# Altium project PCB_Project.PrjPcb
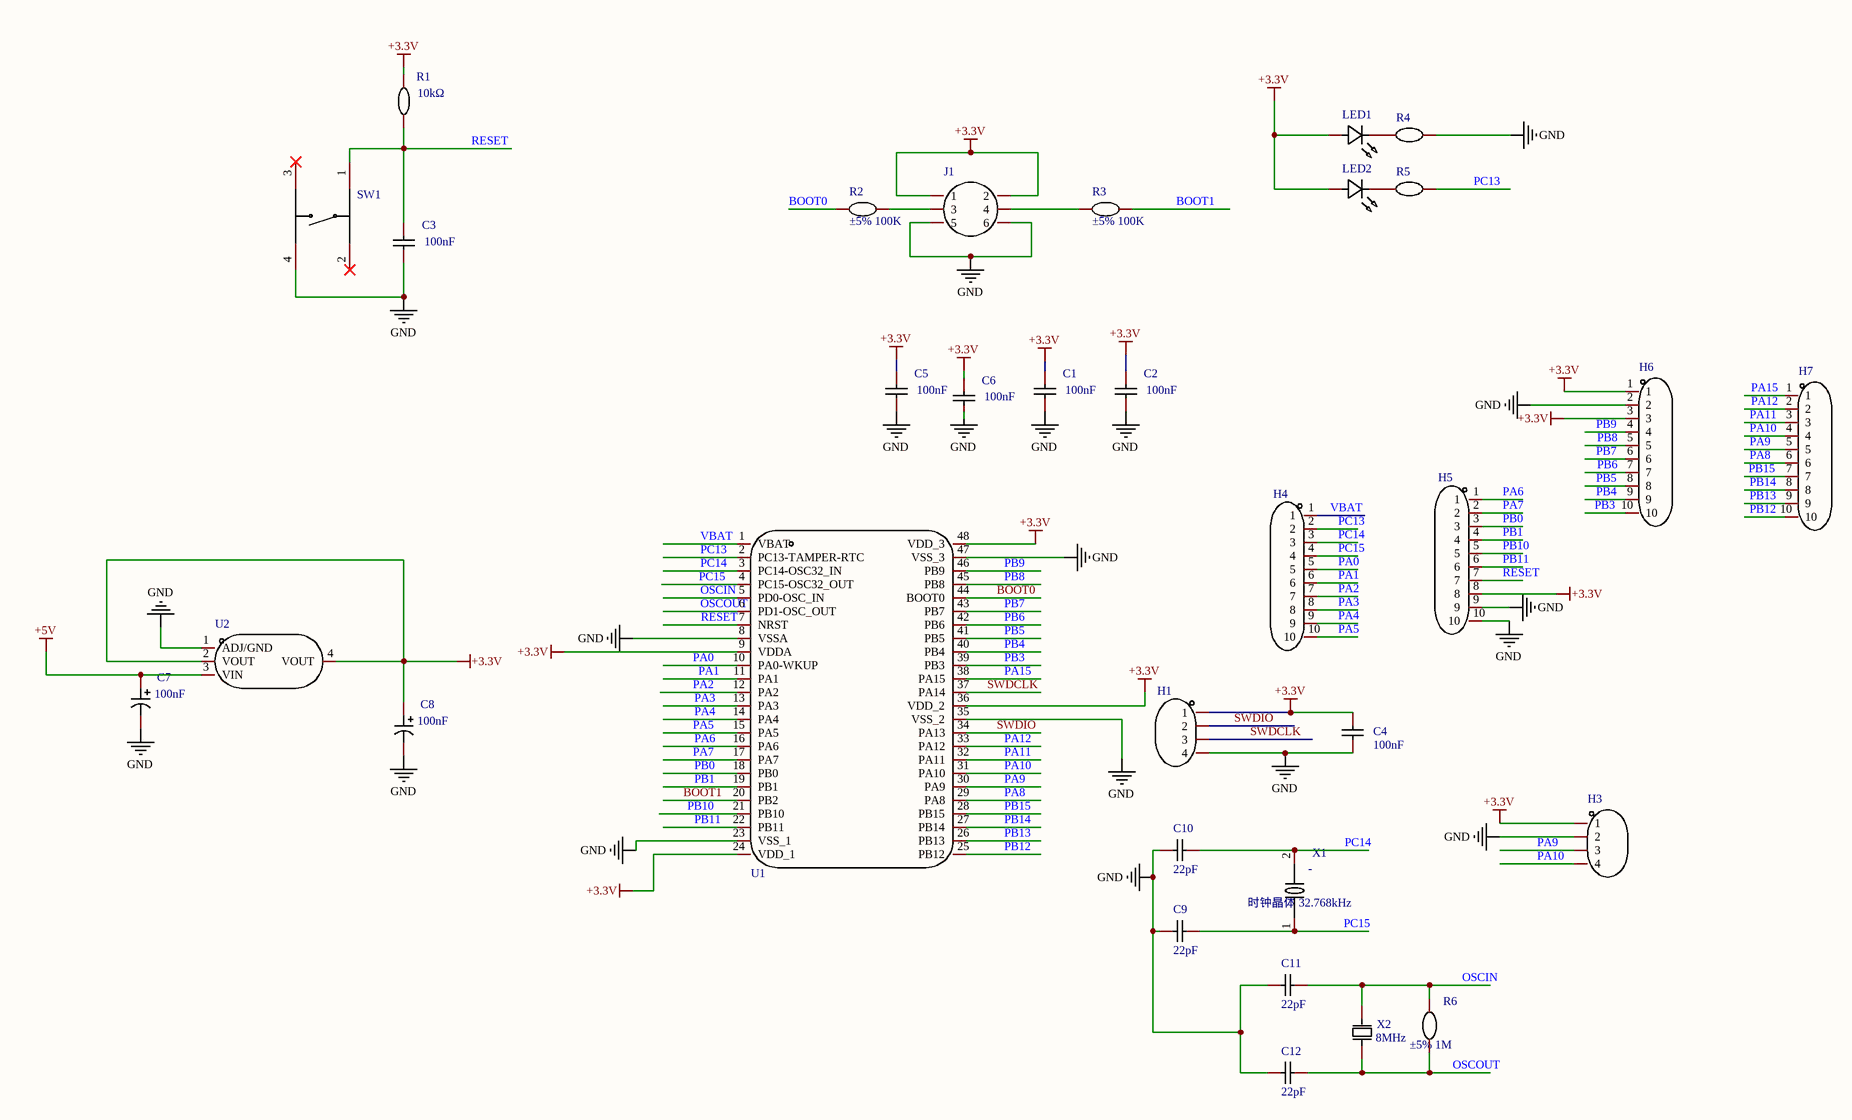
[diagram p0: 1_P1.schdoc]
1 sheet, 32 parts. Net scope: global (net labels, ports and power ports of the same name join across sheets).
Board file: PCB1.PcbDoc

## Sheet 1_P1.schdoc
size 431 x 309 mm; SheetNumber: 1; SheetTotal: 1

### Parts
C1  value 100nF  [C0603]  (hidden comment: CL10F104ZB8NNNC)
C2  value 100nF  [C0603]  (hidden comment: CL10F104ZB8NNNC)
C3  value 100nF  [C0603]  (hidden comment: CL10F104ZB8NNNC)
C4  value 100nF  [C0603]  (hidden comment: CL10F104ZB8NNNC)
C5  value 100nF  [C0603]  (hidden comment: CL10F104ZB8NNNC)
C6  value 100nF  [C0603]  (hidden comment: CL10F104ZB8NNNC)
C7  value 100nF  [CAP-SMD_L3.2-W1.6-RD]  (hidden comment: CA45-A-35V-0.1UF-K)
C8  value 100nF  [CAP-SMD_L3.2-W1.6-RD]  (hidden comment: CA45-A-35V-0.1UF-K)
C9  value 22pF  [C0603]  (hidden comment: CL10C220JB8NNNC)
C10  value 22pF  [C0603]  (hidden comment: CL10C220JB8NNNC)
C11  value 22pF  [C0603]  (hidden comment: CL10C220JB8NNNC)
C12  value 22pF  [C0603]  (hidden comment: CL10C220JB8NNNC)
H1  B-2100S04P-A110  [HDR-TH_4P-P2.54-V-M]  (value not drawn)
H3  B-2100S04P-A110  [HDR-TH_4P-P2.54-V-M]  (value not drawn)
H4  2.54-1*10P针  [HDR-TH_10P-P2.54-V-M-1]  (value not drawn)
H5  2.54-1*10P针  [HDR-TH_10P-P2.54-V-M-1]  (value not drawn)
H6  2.54-1*10P针  [HDR-TH_10P-P2.54-V-M-1]  (value not drawn)
H7  2.54-1*10P针  [HDR-TH_10P-P2.54-V-M-1]  (value not drawn)
J1  2.54-2*3P针  [HDR-TH_6P-P2.54-V-M-R2-C3-S2.54-1]  (value not drawn)
LED1  67-21/RSC-FT2V1B/2T_1  [LED-SMD_L3.1-W2.7-FD-1]  (value not drawn)
LED2  67-21/RSC-FT2V1B/2T_1  [LED-SMD_L3.1-W2.7-FD-1]  (value not drawn)
R1  value 10kΩ  [R1206]  (hidden comment: TR1206D9K00P0550Z)
R2  LCSC Part Name: ±5% 100K  [R2512]  (hidden comment: SCR2512J100K)
R3  LCSC Part Name: ±5% 100K  [R2512]  (hidden comment: SCR2512J100K)
R4  SCR0603J510R  [R0603]  (value not drawn)
R5  SCR0603J510R  [R0603]  (value not drawn)
R6  LCSC Part Name: ±5% 1M  [R0603]  (hidden comment: SCR0603J1M)
SW1  TS-KG02S  [SW-SMD_4P-L6.0-W6.0-P3.90-LS9.5]  (value not drawn)
U1  STM32F103C8T6  [LQFP-48_L7.0-W7.0-P0.50-LS9.0-BL]  (value not drawn)
U2  AMS1117-3.3_C351785  [SOT-223_L6.5-W3.5-P2.30-LS7.0-BR]  (value not drawn)
X1  LCSC Part Name: 时钟晶体 32.768kHz  [OSC-SMD_2P-L1.6-W1.0]  (hidden comment: TFX-04-32.768K)
X2  value 8MHz  [OSC-TH_L11.1-W4.7-P4.88]  (hidden comment: 49SAC08000∞2060)

### Nets
+3.3V: C1.2 C2.2 C4.1 C5.2 C6.2 C8.1 H1.1 H3.1 H5.8 H6.1 H6.3 J1.1 J1.2 LED1.1 LED2.1 R1.2 U1.9(VDDA) U1.24(VDD_1) U1.36(VDD_2) U1.48(VDD_3) U2.2(VOUT) U2.4(VOUT)
+5V: C7.1 U2.3(VIN)
GND: C1.1 C2.1 C3.1 C4.2 C5.1 C6.1 C7.2 C8.2 C9.1 C10.1 C11.1 C12.1 H1.4 H3.2 H5.9 H5.10 H6.2 J1.5 J1.6 R4.2 SW1.4 U1.8(VSSA) U1.23(VSS_1) U1.35(VSS_2) U1.47(VSS_3) U2.1(ADJ/GND)
BOOT0: R2.1 U1.44(BOOT0)
BOOT1: R3.2 U1.20(PB2)
OSCIN: C11.2 R6.2 U1.5(PD0-OSC_IN) X2.2(OSC2)
OSCOUT: C12.2 R6.1 U1.6(PD1-OSC_OUT) X2.1(OSC1)
PA0: H4.5 U1.10(PA0-WKUP)
PA1: H4.6 U1.11(PA1)
PA2: H4.7 U1.12(PA2)
PA3: H4.8 U1.13(PA3)
PA4: H4.9 U1.14(PA4)
PA5: H4.10 U1.15(PA5)
PA6: H5.1 U1.16(PA6)
PA7: H5.2 U1.17(PA7)
PA8: H7.6 U1.29(PA8)
PA9: H3.3 H7.5 U1.30(PA9)
PA10: H3.4 H7.4 U1.31(PA10)
PA11: H7.3 U1.32(PA11)
PA12: H7.2 U1.33(PA12)
PA15: H7.1 U1.38(PA15)
PB0: H5.3 U1.18(PB0)
PB1: H5.4 U1.19(PB1)
PB3: H6.10 U1.39(PB3)
PB4: H6.9 U1.40(PB4)
PB5: H6.8 U1.41(PB5)
PB6: H6.7 U1.42(PB6)
PB7: H6.6 U1.43(PB7)
PB8: H6.5 U1.45(PB8)
PB9: H6.4 U1.46(PB9)
PB10: H5.5 U1.21(PB10)
PB11: H5.6 U1.22(PB11)
PB12: H7.10 U1.25(PB12)
PB13: H7.9 U1.26(PB13)
PB14: H7.8 U1.27(PB14)
PB15: H7.7 U1.28(PB15)
PC13: H4.2 R5.2 U1.2(PC13-TAMPER-RTC)
PC14: C10.2 H4.3 U1.3(PC14-OSC32_IN) X1.2
PC15: C9.2 H4.4 U1.4(PC15-OSC32_OUT) X1.1
RESET: C3.2 H5.7 R1.1 SW1.1 U1.7(NRST)
SWDCLK: H1.3 U1.37(PA14)
SWDIO: H1.2 U1.34(PA13)
VBAT: H4.1 U1.1(VBAT)
NetJ1_3: J1.3 R2.2
NetJ1_4: J1.4 R3.1
NetLED1_2: LED1.2 R4.1
NetLED2_2: LED2.2 R5.1

Not connected (* = marked no-connect by the designer): SW1 2* 3*

### Library data of the parts
C1-C6 = CL10F104ZB8NNNC: 容值:100nF;精度:-20%~+80%;额定电压:50V;材质(温度系数):Y5V;; Manufacturer: SAMSUNG(三星); Add into BOM: yes; Voltage Rated: 50V; Temperature Coefficient: Y5V; Symbol: CL10F104ZB8NNNC; Device: CL10F104ZB8NNNC; LCSC Part Name: 100nF -20%~+80% 50V; Supplier Part: C1688; Manufacturer Part: CL10F104ZB8NNNC; Supplier Footprint: 0603; JLCPCB Part Class: Extended Part; Datasheet: https://atta.szlcsc.com/upload/public/pdf/source/20160103/1457707690730.pdf; Supplier: LCSC; Convert to PCB: yes; Tolerance: -20%~+80%
C7 C8 = CA45-A-35V-0.1UF-K: 容值:100nF;精度:±10%;额定电压:35V;工作温度:-55~+125;; Manufacturer: CEC(振华新云); Add into BOM: yes; Tolerance: ±10%; Rated Voltage: 35V; Symbol: CA45-A-35V-0.1UF-K; Device: CA45-A-35V-0.1UF-K; LCSC Part Name: 100nF ±10% 35V; Supplier Part: C2976900; Manufacturer Part: CA45-A-35V-0.1UF-K; Supplier Footprint: SMD,3.2x1.6x1.6mm; JLCPCB Part Class: Extended Part; Datasheet: https://atta.szlcsc.com/upload/public/pdf/source/20220222/C2C5F368BEBB90E653B4407F98E5644A.pdf; Supplier: LCSC; Convert to PCB: yes; Operating Temperature: -55~+125
C9-C12 = CL10C220JB8NNNC: 容值:22pF;精度:±5%;额定电压:50V;材质(温度系数):C0G;; Manufacturer: SAMSUNG(三星); Add into BOM: yes; Tolerance: ±5%; Voltage Rated: 50V; Temperature Coefficient: C0G; Symbol: CL10C220JB8NNNC; Device: CL10C220JB8NNNC; LCSC Part Name: 22pF ±5% 50V; Supplier Part: C1653; Manufacturer Part: CL10C220JB8NNNC; Supplier Footprint: 0603; JLCPCB Part Class: Basic Part; Datasheet: https://atta.szlcsc.com/upload/public/pdf/source/20160103/1457707687317.pdf; Supplier: LCSC; Convert to PCB: yes
H1 H3 = B-2100S04P-A110: 间距:2.54mm;总PIN位数:4;排数:1;插针结构:1x4P;行距:-;安装类型:直插;圆针/方针:-;额定电流:-;额定电压:-;配合针长度:6mm;塑高:2.54mm;端接针长度:3mm;触头材质:黄铜;触头镀层:-;工作温度范围:-40~+105;颜色:黑色;; Manufacturer: Ckmtw(灿科盟); Symbol: Header-Male-2.54_1x4; Add into BOM: yes; Pitch: 2.54mm; Pin Structure: 1x4P; Device: B-2100S04P-A110; LCSC Part Name: 2.54mm 1x4P 直插; Supplier Part: C124378; Manufacturer Part: B-2100S04P-A110; Supplier Footprint: 直插,P=2.54mm; JLCPCB Part Class: Extended Part; Datasheet: https://atta.szlcsc.com/upload/public/pdf/source/20170821/C124378_1503303307508901532.pdf; Supplier: LCSC; Convert to PCB: yes; Number of Pins: 4; Number of Rows: 1; Row Spacing: -; Mounting Type: 直插; Circluar Pins/Square Pins: -; Current Rating (Max): -; Voltage Rating (Max): -; Length of Mating Pin: 6mm; Insulation Height: 2.54mm; Length of End Connection Pin: 3mm; Contact Material: 黄铜; Contact Plating: -; Operating Temperature Range: -40~+105; Color: 黑色
H4-H7 = 2.54-1*10P针: 间距:2.54mm;总PIN位数:10;排数:1;插针结构:1x10P;行距:-;安装类型:直插;圆针/方针:方针;额定电流:3A;额定电压:-;配合针长度:-;塑高:-;端接针长度:-;触头材质:-;触头镀层:-;工作温度范围:-40~+105;颜色:黑色;; Manufacturer: BOOMELE(博穆精密); Symbol: Header-Male-2.54_1x10; Add into BOM: yes; Pitch: 2.54mm; Pin Structure: 1x10P; Circluar Pins/Square Pins: 方针; Current Rating (Max): 3A; Device: 2.54-1*10P针; LCSC Part Name: 2.54mm 1x10P 直插 方针; Supplier Part: C57369; Manufacturer Part: 2.54-1*10P针; Supplier Footprint: 插件,P=2.54mm; JLCPCB Part Class: Extended Part; Datasheet: https://atta.szlcsc.com/upload/public/pdf/source/20151109/1457707572883.pdf; Supplier: LCSC; Convert to PCB: yes; Number of Pins: 10; Number of Rows: 1; Row Spacing: -; Mounting Type: 直插; Voltage Rating (Max): -; Length of Mating Pin: -; Insulation Height: -; Length of End Connection Pin: -; Contact Material: -; Contact Plating: -; Operating Temperature Range: -40~+105; Color: 黑色
J1 = 2.54-2*3P针: 间距:2.54mm;总PIN位数:6;排数:2;插针结构:-;行距:-;安装类型:直插;圆针/方针:-;额定电流:-;额定电压:-;配合针长度:-;塑高:-;触头材质:-;触头镀层:-;颜色:黑色;; Manufacturer: BOOMELE(博穆精密); Symbol: Header-Male-2.54_2x3; Add into BOM: yes; Pitch: 2.54mm; Device: 2.54-2*3P针; LCSC Part Name: 2.54mm 直插; Supplier Part: C65114; Manufacturer Part: 2.54-2*3P针; Supplier Footprint: 直插,P=2.54mm; JLCPCB Part Class: Extended Part; Datasheet: https://atta.szlcsc.comnull; Supplier: LCSC; Convert to PCB: yes; Number of Pins: 6; Number of Rows: 2; Pin Structure: -; Row Spacing: -; Mounting Type: 直插; Circluar Pins/Square Pins: -; Current Rating (Max): -; Voltage Rating (Max): -; Length of Mating Pin: -; Insulation Height: -; Contact Material: -; Contact Plating: -; Color: 黑色
LED1 LED2 = 67-21/RSC-FT2V1B/2T_1: Manufacturer: EVERLIGHT(亿光); Symbol: 67-21/RSC-FT2V1B/2T_C4749159; Add into BOM: yes; Device: 67-21/RSC-FT2V1B/2T_1; LCSC Part Name: LED; Supplier Part: C4749159; Manufacturer Part: 67-21/RSC-FT2V1B/2T; Supplier Footprint: SMD-2,2.7x3.1mm; JLCPCB Part Class: Extended Part; Datasheet: https://atta.szlcsc.com/upload/public/pdf/source/20220713/BE7199A589B2EC6E250CD65CD7D14552.pdf; Supplier: LCSC; Convert to PCB: yes
R1 = TR1206D9K00P0550Z: 电阻类型:薄膜电阻;阻值:9kΩ;精度:±0.5%;功率:250mW;温度系数:±50ppm/;最大工作电压:200V;工作温度范围:-55~+155;; Manufacturer: EVER OHMS(天二科技); Symbol: TR1206D9KP0550; Add into BOM: yes; Tolerance: ±0.5%; Power(Watts): 250mW; Temperature Coefficient: ±50ppm/; Overload Voltage (Max): 200V; Device: TR1206D9K00P0550Z; LCSC Part Name: 9kΩ ±0.5%; Supplier Part: C150026; Manufacturer Part: TR1206D9K00P0550Z; Supplier Footprint: 1206; JLCPCB Part Class: Extended Part; Datasheet: https://atta.szlcsc.com/upload/public/pdf/source/20190415/C150026_5B6B5529535D7231535B38A00DA69B28.pdf; Supplier: LCSC; Convert to PCB: yes; Type: 薄膜电阻; Operating Temperature Range: -55~+155
R2 R3 = SCR2512J100K: Manufacturer: VO(翔胜); Add into BOM: yes; Symbol: SCR2512J100K; Device: SCR2512J100K; Supplier Part: C3018375; Manufacturer Part: SCR2512J100K; Supplier Footprint: 2512; JLCPCB Part Class: Extended Part; Datasheet: https://atta.szlcsc.com/upload/public/pdf/source/20220513/247AF9639BA21CF93567DC289CCC6A22.pdf; Supplier: LCSC; Convert to PCB: yes
R4 R5 = SCR0603J510R: Manufacturer: VO(翔胜); Add into BOM: yes; Symbol: SCR0603J510R; Device: SCR0603J510R; LCSC Part Name: ±5% 510R; Supplier Part: C3017743; Manufacturer Part: SCR0603J510R; Supplier Footprint: 0603; JLCPCB Part Class: Extended Part; Datasheet: https://atta.szlcsc.com/upload/public/pdf/source/20220513/247AF9639BA21CF93567DC289CCC6A22.pdf; Supplier: LCSC; Convert to PCB: yes
R6 = SCR0603J1M: Manufacturer: VO(翔胜); Add into BOM: yes; Symbol: SCR0603J1M; Device: SCR0603J1M; Supplier Part: C3017671; Manufacturer Part: SCR0603J1M; Supplier Footprint: 0603; JLCPCB Part Class: Extended Part; Datasheet: https://atta.szlcsc.com/upload/public/pdf/source/20220513/247AF9639BA21CF93567DC289CCC6A22.pdf; Supplier: LCSC; Convert to PCB: yes
SW1 = TS-KG02S: 触点电流:50mA;额定电压(DC):12V;绝缘电阻:100MΩ;电路结构:单刀单掷;安装方式:立贴;按钮形状:圆形按钮;带灯:-;开关长度:6mm;开关宽度:6mm;开关高度:4.3mm;; Manufacturer: 汉博(HANBO); Add into BOM: yes; Contact Current: 50mA; Voltage Rating (DC): 12V; Insulation Resistance: 100MΩ; Circuit: 单刀单掷; Actuator Style: 圆形按钮; Switch Length: 6mm; Switch Height: 4.3mm; Symbol: TS-KG02S; Device: TS-KG02S; LCSC Part Name: 6*6轻触贴片微动按键开关四脚; Supplier Part: C410366; Manufacturer Part: TS-KG02S; Supplier Footprint: SMD,6x6x4.3mm; JLCPCB Part Class: Extended Part; Datasheet: https://atta.szlcsc.com/upload/public/pdf/source/20201230/C410366_9ED50E2AC39ADCBB1E9D3DFF4A46B08A.pdf; Supplier: LCSC; Convert to PCB: yes; Mounting Style: 立贴; With Lamp: -; Switch Width: 6mm
U1 = STM32F103C8T6: CPU内核:ARM Cortex-M3;CPU最大主频:72MHz;工作电压范围:2V~3.6V;内部振荡器:有;程序 FLASH容量:64K@x8bit;RAM总容量:20KB;EEPROM/数据 FLASH容量:-;GPIO端口数量:37;ADC(单元数/通道数/位数):1@x10ch/12bit;外设/功能/协议栈:温度传感器；DMA；看门狗；POR；PWM;工作温度范围:-40~+85;; Manufacturer: ST(意法半导体); Add into BOM: yes; Maximum Frequency: 72MHz; Internal Oscillator: 有; RAM Size: 20KB; GPIO Ports Number: 37; Symbol: STM32F103C8T6; Device: STM32F103C8T6; LCSC Part Name: STM32F103C8T6 MSL=3; Supplier Part: C8734; Manufacturer Part: STM32F103C8T6; Supplier Footprint: LQFP-48_7x7x05P; JLCPCB Part Class: Basic Part; Datasheet: https://atta.szlcsc.com/upload/public/pdf/source/20140724/1457707174202.pdf; Supplier: LCSC; Convert to PCB: yes; CPU Core: ARM Cortex-M3; Supply Voltage Range: 2V~3.6V; Program FLASH Size: 64K@x8bit; EEPROM/Data FLASH Size: -; ADC (Units/Channels/bits): 1@x10ch/12bit; Peripherals / Functions / Protocol Stacks: 温度传感器；DMA；看门狗；POR；PWM; Operating Temperature Range: -40~+85
U2 = AMS1117-3.3_C351785: Manufacturer: PUOLOP(迪浦); Add into BOM: yes; Symbol: AMS1117-3.3_C351785; Device: AMS1117-3.3_C351785; LCSC Part Name: AMS1117-3.3; Supplier Part: C351785; Manufacturer Part: AMS1117-3.3; Supplier Footprint: SOT-223; JLCPCB Part Class: Extended Part; Datasheet: https://atta.szlcsc.com/upload/public/pdf/source/20210915/EA806799CEEC3F52E0A4FA8303A508AC.pdf; Supplier: LCSC; Convert to PCB: yes
X1 = TFX-04-32.768K: 晶振类型:-;频率:-;频率公差:-;频率稳定度:-;负载电容:-;工作温度:-;; Manufacturer: RIVER(大河); Symbol: TFX-04-32.768K_C515348; Add into BOM: yes; Device: TFX-04-32.768K; Supplier Part: C515348; Manufacturer Part: TFX-04-32.768K; Supplier Footprint: SMD1610-2P; JLCPCB Part Class: Extended Part; Datasheet: https://atta.szlcsc.com/upload/public/pdf/source/20200917/C515346_EDFB4A3F7406CD145B2E2A90CB656616.pdf; Supplier: LCSC; Convert to PCB: yes; Crystal Type: -; Value: -; Frequency Tolerance: -; Frequency Stability: -; Load Capacitance: -; Operating Temperature: -
X2 = 49SAC08000∞2060: 晶振类型:49S晶振;频率:8MHz;频率公差:±20ppm;频率稳定度:±20ppm;负载电容:-;等效串联电阻(ESR):60Ω;工作温度:-40~+85;; Manufacturer: JGHC(晶光华); Manufacturer Part: 49SAC080002060; Add into BOM: yes; Crystal Type: 49S晶振; Frequency Tolerance: ±20ppm; Equivalent Series Resistance (ESR): 60Ω; Symbol: 49SAC08000∞2060; Device: 49SAC08000∞2060; LCSC Part Name: 8MHz ±20ppm PF; Supplier Part: C443528; Supplier Footprint: HC-49S; JLCPCB Part Class: Extended Part; Datasheet: https://atta.szlcsc.com/upload/public/pdf/source/20220509/DA0409DDE0EE6F4AE04A7DAE191F9F4C.pdf; Supplier: LCSC; Convert to PCB: yes; Frequency Stability: ±20ppm; Load Capacitance: -; Operating Temperature: -40~+85